# Altium schematic sheet 0123_LPSS- I2C3_I2C4_I2.SchDoc
size A3
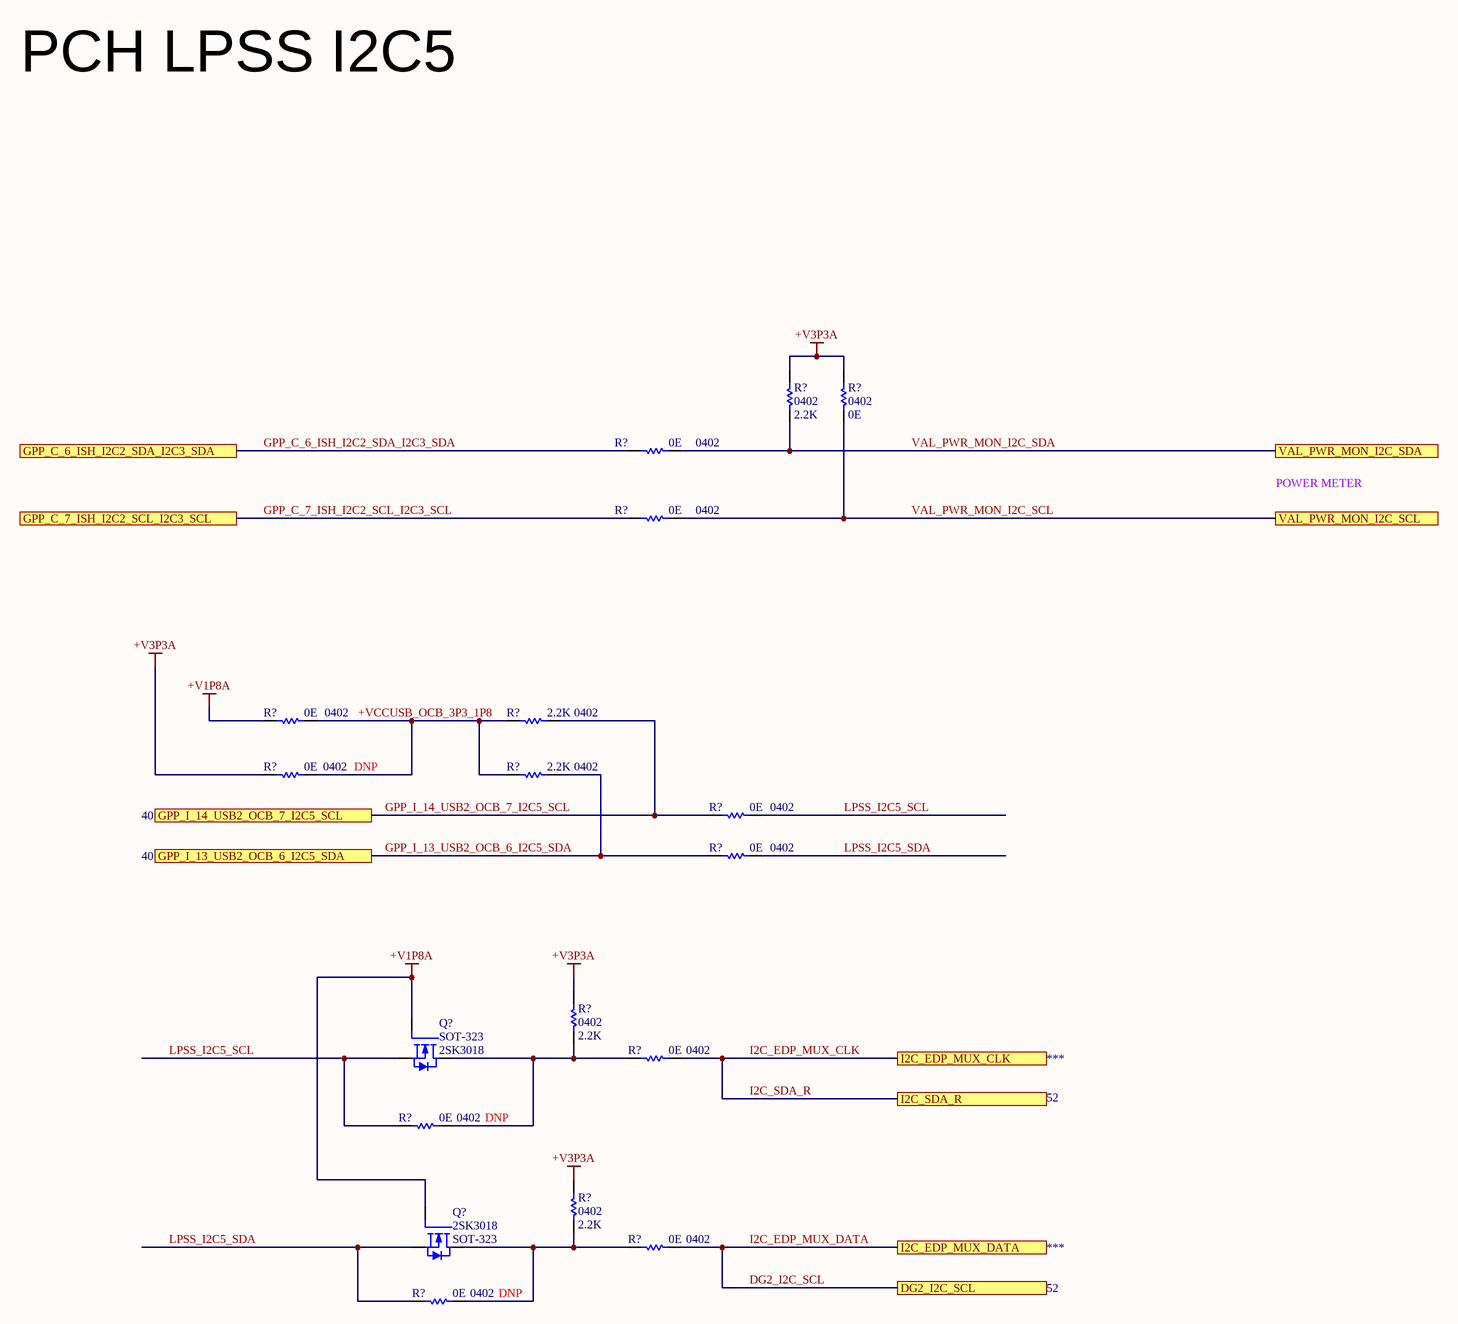
[diagram p0: 0123_LPSS- I2C3_I2C4_I2.SchDoc]

## Parts
(Parts that share a designator on the sheet are numbered #1, #2 ... from top to bottom, then left to right.)
Q?#1  Manufacturer Part Number: 2SK3018  Case/Package: SOT-323  [SOT323]  (hidden comment: MOSFET N_2SK3018)
Q?#2  Manufacturer Part Number: 2SK3018  Case/Package: SOT-323  [SOT323]  (hidden comment: MOSFET N_2SK3018)
R?#1  value 2.2K  Case/Package: 0402  [RESC0402]  (hidden comment: Res)
R?#2  value 0E  Case/Package: 0402  [RESC0402]  (hidden comment: Res)
R?#3  value 0E  Case/Package: 0402  [RESC0402]  (hidden comment: Res)
R?#4  value 0E  Case/Package: 0402  [RESC0402]  (hidden comment: Res)
R?#5  value 0E  Case/Package: 0402  [RESC0402]  (hidden comment: Res)
R?#6  value 2.2K  Case/Package: 0402  [RESC0402]  (hidden comment: Res)
R?#7  value 0E  Case/Package: 0402  [RESC0402]  (hidden comment: Res)
R?#8  value 2.2K  Case/Package: 0402  [RESC0402]  (hidden comment: Res)
R?#9  value 0E  Case/Package: 0402  [RESC0402]  (hidden comment: Res)
R?#10  value 0E  Case/Package: 0402  [RESC0402]  (hidden comment: Res)
R?#11  value 2.2K  Case/Package: 0402  [RESC0402]  (hidden comment: Res)
R?#12  value 0E  Case/Package: 0402  [RESC0402]  (hidden comment: Res)
R?#13  value 0E  Case/Package: 0402  [RESC0402]  (hidden comment: Res)
R?#14  value 2.2K  Case/Package: 0402  [RESC0402]  (hidden comment: Res)
R?#15  value 0E  Case/Package: 0402  [RESC0402]  (hidden comment: Res)
R?#16  value 0E  Case/Package: 0402  [RESC0402]  (hidden comment: Res)

## Ports
DG2_I2C_SCL, GPP_C_6_ISH_I2C2_SDA_I2C3_SDA, GPP_C_7_ISH_I2C2_SCL_I2C3_SCL, GPP_I_13_USB2_OCB_6_I2C5_SDA, GPP_I_14_USB2_OCB_7_I2C5_SCL, I2C_EDP_MUX_CLK, I2C_EDP_MUX_DATA, I2C_SDA_R, VAL_PWR_MON_I2C_SCL, VAL_PWR_MON_I2C_SDA

## Nets
+V1P8A: Q?#1.1(GATE) Q?#2.1(GATE) R?#5.1
+V3P3A: R?#1.2 R?#2.2 R?#7.1 R?#11.2 R?#14.2
+VCCUSB_OCB_3P3_1P8: R?#5.2 R?#6.1 R?#7.2 R?#8.1
DG2_I2C_SCL: R?#15.2 ; port I2C_EDP_MUX_DATA, port DG2_I2C_SCL  [also labelled I2C_EDP_MUX_DATA]
GPP_C_6_ISH_I2C2_SDA_I2C3_SDA: R?#3.1 ; port GPP_C_6_ISH_I2C2_SDA_I2C3_SDA
GPP_C_7_ISH_I2C2_SCL_I2C3_SCL: R?#4.1 ; port GPP_C_7_ISH_I2C2_SCL_I2C3_SCL
GPP_I_13_USB2_OCB_6_I2C5_SDA: R?#8.2 R?#10.1 ; port GPP_I_13_USB2_OCB_6_I2C5_SDA
GPP_I_14_USB2_OCB_7_I2C5_SCL: R?#6.2 R?#9.1 ; port GPP_I_14_USB2_OCB_7_I2C5_SCL
I2C_EDP_MUX_CLK: R?#12.2 ; port I2C_EDP_MUX_CLK, port I2C_SDA_R  [also labelled I2C_SDA_R]
LPSS_I2C5_SCL: Q?#1.2(SOURCE) R?#9.2 R?#13.1
LPSS_I2C5_SDA: Q?#2.2(SOURCE) R?#10.2 R?#16.1
VAL_PWR_MON_I2C_SCL: R?#2.1 R?#4.2 ; port VAL_PWR_MON_I2C_SCL
VAL_PWR_MON_I2C_SDA: R?#1.1 R?#3.2 ; port VAL_PWR_MON_I2C_SDA
NetQ?#1_3: Q?#1.3(DRAIN) R?#11.1 R?#12.1 R?#13.2
NetQ?#2_3: Q?#2.3(DRAIN) R?#14.1 R?#15.1 R?#16.2

## Notes on the sheet
- PCH LPSS I2C5
- POWER METER

## Library data of the parts
Q?#1 Q?#2 = MOSFET N_2SK3018: NMOS,2SK3018,SOT_323,Id=0.1A,Vds=30V
R?#1 R?#6 R?#8 = Res: Thick Film Resistor -  2.2Kohm, 1%, 0402
R?#2-R?#5 R?#7 R?#9-R?#16 = Res: Thick Film Resistor -  0ohm, 1%, 0402
  R?#7 R?#13 R?#16: DNP: DNP